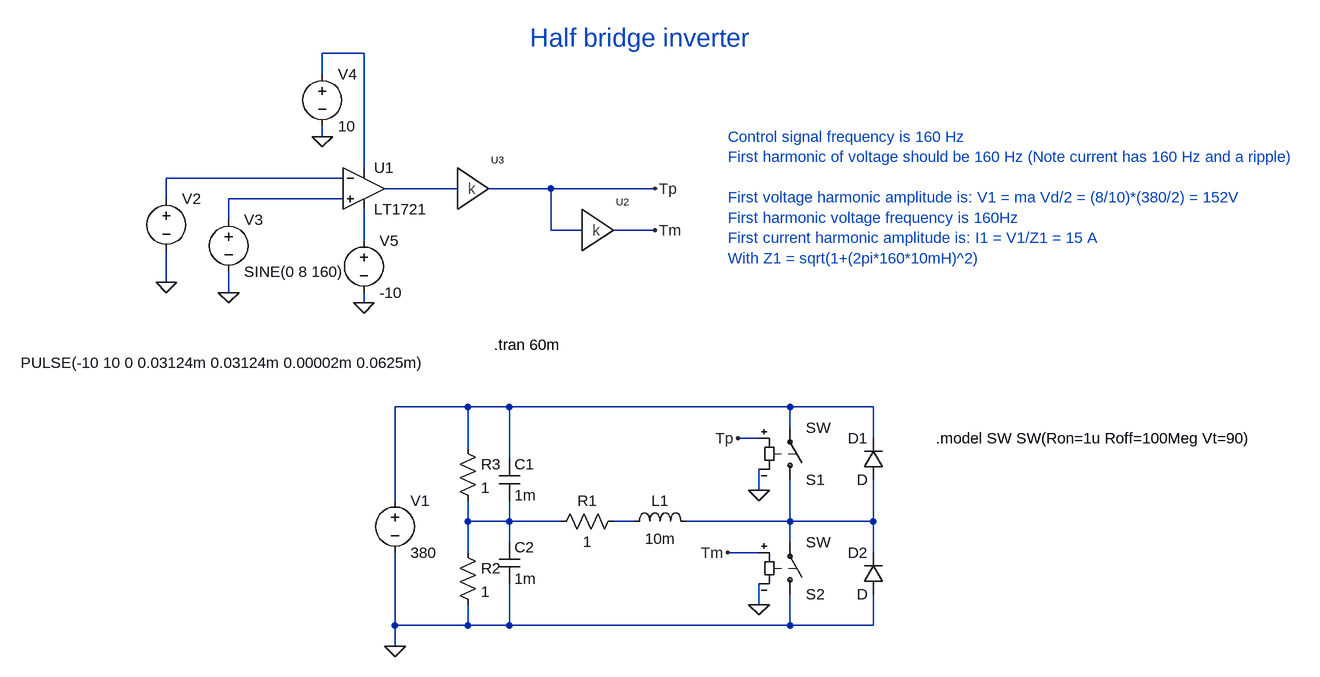
[diagram p0: schematic Half-bridge-inverter.asc]
Half-bridge-inverter.asc, the LTspice schematic file:
Version 4.1
SHEET 1 1668 680
WIRE -48 -496 -112 -496
WIRE -112 -464 -112 -496
WIRE -112 -368 -112 -384
WIRE -48 -320 -48 -496
WIRE -80 -304 -352 -304
WIRE 96 -288 -16 -288
WIRE 240 -288 144 -288
WIRE 400 -288 240 -288
WIRE -352 -272 -352 -304
WIRE -80 -272 -256 -272
WIRE -256 -240 -256 -272
WIRE 240 -224 240 -288
WIRE 288 -224 240 -224
WIRE 400 -224 336 -224
WIRE -48 -208 -48 -256
WIRE -352 -144 -352 -192
WIRE -256 -128 -256 -160
WIRE -48 -112 -48 -128
WIRE 112 48 0 48
WIRE 176 48 112 48
WIRE 608 48 176 48
WIRE 736 48 608 48
WIRE 608 80 608 48
WIRE 560 96 528 96
WIRE 736 96 736 48
WIRE 112 112 112 48
WIRE 176 128 176 48
WIRE 560 176 560 144
WIRE 0 192 0 48
WIRE 112 224 112 192
WIRE 176 224 176 192
WIRE 176 224 112 224
WIRE 256 224 176 224
WIRE 368 224 336 224
WIRE 608 224 608 160
WIRE 608 224 448 224
WIRE 736 224 736 160
WIRE 736 224 608 224
WIRE 176 256 176 224
WIRE 608 256 608 224
WIRE 112 272 112 224
WIRE 560 272 512 272
WIRE 736 272 736 224
WIRE 560 352 560 320
WIRE 0 384 0 272
WIRE 112 384 112 352
WIRE 112 384 0 384
WIRE 176 384 176 320
WIRE 176 384 112 384
WIRE 608 384 608 336
WIRE 608 384 176 384
WIRE 736 384 736 336
WIRE 736 384 608 384
WIRE 0 416 0 384
FLAG 560 176 0
FLAG 560 352 0
FLAG 0 416 0
FLAG -112 -368 0
FLAG -48 -112 0
FLAG -256 -128 0
FLAG -352 -144 0
FLAG 400 -288 Tp
FLAG 400 -224 Tm
FLAG 528 96 Tp
FLAG 512 272 Tm
SYMBOL voltage 0 176 R0
WINDOW 123 0 0 Left 0
WINDOW 39 0 0 Left 0
SYMATTR InstName V1
SYMATTR Value 380
SYMBOL cap 160 128 R0
SYMATTR InstName C1
SYMATTR Value 1m
SYMATTR SpiceLine Rser=1m Rpar=1Meg
SYMBOL cap 160 256 R0
SYMATTR InstName C2
SYMATTR Value 1m
SYMATTR SpiceLine Rser=1m Rpar=1Meg
SYMBOL res 352 208 R90
WINDOW 0 0 56 VBottom 2
WINDOW 3 32 56 VTop 2
SYMATTR InstName R1
SYMATTR Value 1
SYMBOL ind 352 240 R270
WINDOW 0 32 56 VTop 2
WINDOW 3 5 56 VBottom 2
SYMATTR InstName L1
SYMATTR Value 10m
SYMBOL sw 608 176 M180
SYMATTR InstName S1
SYMBOL diode 752 160 R180
WINDOW 0 24 64 Left 2
WINDOW 3 24 0 Left 2
SYMATTR InstName D1
SYMBOL sw 608 352 M180
SYMATTR InstName S2
SYMBOL diode 752 336 R180
WINDOW 0 24 64 Left 2
WINDOW 3 24 0 Left 2
SYMATTR InstName D2
SYMBOL voltage -256 -256 R0
WINDOW 123 0 0 Left 0
WINDOW 39 0 0 Left 0
SYMATTR InstName V3
SYMATTR Value SINE(0 8 160)
SYMBOL Comparators\\LT1721 -48 -352 R0
SYMATTR InstName U1
SYMBOL voltage -112 -480 R0
WINDOW 123 0 0 Left 0
WINDOW 39 0 0 Left 0
SYMATTR InstName V4
SYMATTR Value 10
SYMBOL voltage -48 -224 R0
WINDOW 123 0 0 Left 0
WINDOW 39 0 0 Left 0
SYMATTR InstName V5
SYMATTR Value -10
SYMBOL Gain 304 -224 R0
SYMATTR InstName U2
SYMBOL voltage -352 -288 R0
WINDOW 3 -224 268 Left 2
WINDOW 123 0 0 Left 0
WINDOW 39 0 0 Left 0
SYMATTR Value PULSE(-10 10 0 0.03124m 0.03124m 0.00002m 0.0625m)
SYMATTR InstName V2
SYMBOL Gain 112 -288 R0
SYMATTR SpiceLine G=100
SYMATTR InstName U3
SYMBOL res 96 256 R0
SYMATTR InstName R2
SYMATTR Value 1
SYMBOL res 96 96 R0
SYMATTR InstName R3
SYMATTR Value 1
TEXT 832 96 Left 2 !.model SW SW(Ron=1u Roff=100Meg Vt=90)
TEXT 152 -48 Left 2 !.tran 60m
TEXT 512 -368 Left 2 ;Control signal frequency is 160 Hz\nFirst harmonic of voltage should be 160 Hz (Note current has 160 Hz and a ripple)\n \nFirst voltage harmonic amplitude is: V1 = ma Vd/2 = (8/10)*(380/2) = 152V\nFirst harmonic voltage frequency is 160Hz\nFirst current harmonic amplitude is: I1 = V1/Z1 = 15 A\nWith Z1 = sqrt(1+(2pi*160*10mH)^2)
TEXT 208 -520 Left 4 ;Half bridge inverter

The netlist it stands for:
* Half-bridge-inverter.asc
V1 N006 0 380
C1 N006 N007 1m Rser=1m Rpar=1Meg
C2 N007 0 1m Rser=1m Rpar=1Meg
R1 N008 N007 1
L1 N008 N009 10m
S1 N009 N006 Tp 0 SW
D1 N009 N006 D
S2 0 N009 Tm 0 SW
D2 0 N009 D
V3 N004 0 SINE(0 8 160)
X§U1 N004 N002 N001 N005 N003 LT1720  ; LT1721, pins In+ In- V+ V- OUT
V4 N001 0 10
V5 N005 0 -10
E§U2 Tp Tm G={G}
V2 N002 0 PULSE(-10 10 0 0.03124m 0.03124m 0.00002m 0.0625m)
E§U3 N003 Tp G={G} G=100
R2 N007 0 1
R3 N006 N007 1
.model D D
.lib standard.dio
.model SW SW(Ron=1u Roff=100Meg Vt=90)
.tran 60m
* Control signal frequency is 160 Hz
* First harmonic of voltage should be 160 Hz (Note current has 160 Hz and a ripple)
* First voltage harmonic amplitude is: V1 = ma Vd/2 = (8/10)*(380/2) = 152V
* First harmonic voltage frequency is 160Hz
* First current harmonic amplitude is: I1 = V1/Z1 = 15 A
* With Z1 = sqrt(1+(2pi*160*10mH)^2)
* Half bridge inverter
.lib LTC.lib
.backanno
.end